# Altium schematic sheet 48V_Converter.SchDoc
size A
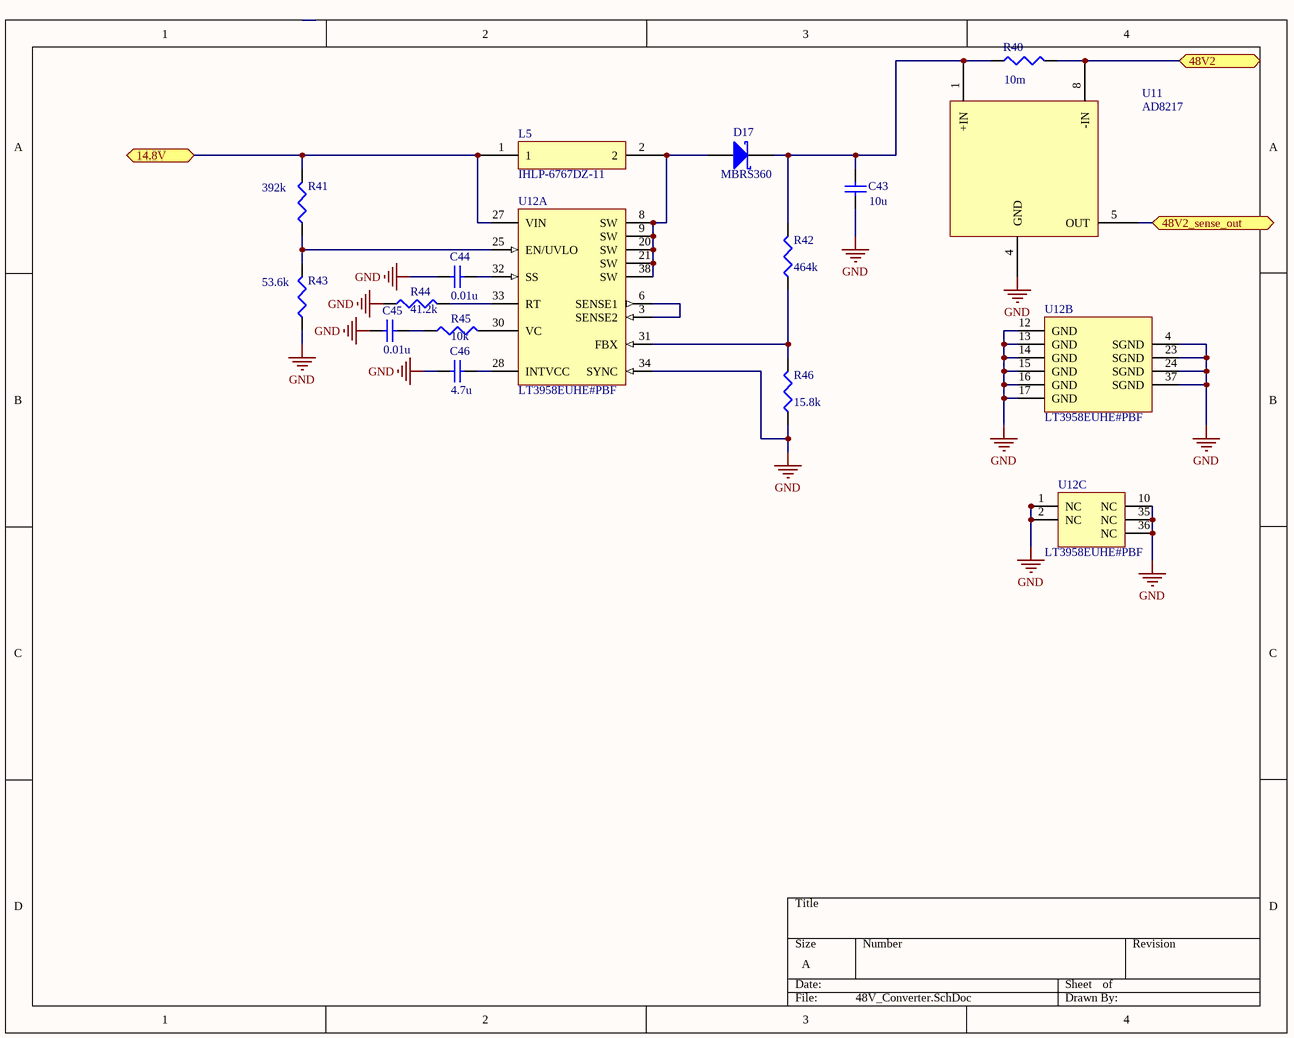
[diagram p0: 48V_Converter.SchDoc]

## Parts
C43  value 10u  [C1206]  (hidden comment: Cap Semi)
C44  value 0.01u  [C1206]  (hidden comment: Cap Semi)
C45  value 0.01u  [C1206]  (hidden comment: Cap Semi)
C46  value 4.7u  [C1206]  (hidden comment: Cap Semi)
D17  MBRS360  [SMB]
L5  IHLP-6767DZ-11  [IHLP-6767DZ-11]
R40  value 10m  [J1-0603]  (hidden comment: Res3)
R41  value 392k  [J1-0603]  (hidden comment: Res3)
R42  value 464k  [J1-0603]  (hidden comment: Res3)
R43  value 53.6k  [J1-0603]  (hidden comment: Res3)
R44  value 41.2k  [J1-0603]  (hidden comment: Res3)
R45  value 10k  [J1-0603]  (hidden comment: Res3)
R46  value 15.8k  [J1-0603]  (hidden comment: Res3)
U11  AD8217  [AD8217]
U12  LT3958EUHE#PBF  [LT3958]  (parts A,B,C of 3)

## Ports
14.8V, 48V2, 48V2_sense_out

## Nets
GND: C43.1 C44.1 C45.1 C46.1 R43.1 R44.1 R46.1 U11.4(GND) U12.1(NC) U12.2(NC) U12.4(SGND) U12.10(NC) U12.12(GND) U12.13(GND) U12.14(GND) U12.15(GND) U12.16(GND) U12.17(GND) U12.23(SGND) U12.24(SGND) U12.34(SYNC) U12.35(NC) U12.36(NC) U12.37(SGND)
14.8V: L5.1 R41.2 U12.27(VIN) ; port 14.8V
48V2: R40.2 U11.8(-IN) ; port 48V2
48V2_sense_out: U11.5(OUT) ; port 48V2_sense_out
NetC43_2: C43.2 D17.2(K) R40.1 R42.2 U11.1(+IN)
NetC44_2: C44.2 U12.32(SS)
NetC45_2: C45.2 R45.1
NetC46_2: C46.2 U12.28(INTVCC)
NetD17_1: D17.1(A) L5.2 U12.8(SW) U12.9(SW) U12.20(SW) U12.21(SW) U12.38(SW)
NetR41_1: R41.1 R43.2 U12.25(EN/UVLO)
NetR42_1: R42.1 R46.2 U12.31(FBX)
NetR44_2: R44.2 U12.33(RT)
NetR45_2: R45.2 U12.30(VC)
NetU12_3: U12.3(SENSE2) U12.6(SENSE1)

## Library data of the parts
C43-C46 = Cap Semi: Capacitor (Semiconductor SIM Model); Published: 8-Jun-2000; LatestRevisionDate: 29-May-2009; LatestRevisionNote: IPC-7351 Footprint Added.; PackageReference: C1206; Publisher: Altium Limited; PackageDescription: Chip Capacitor
D17 = D Schottky: Schottky Diode; Published: 8-Jun-2000; LatestRevisionDate: 17-Jul-2002; LatestRevisionNote: Re-released for DXP Platform.; PackageReference: SMB; Publisher: Altium Limited; PackageDescription: DO-214-AA/SMB; 2 C-Bend Leads; Body 5.3 x 3.6 mm, inc. leads (LxW); Code_JEDEC: DO-214-AA
L5 = IHLP-6767DZ-11: Inductor
R40-R46 = Res3: Resistor; Published: 8-Jun-2000; LatestRevisionDate: 29-May-2009; LatestRevisionNote: IPC-7351 Footprint Added.; PackageReference: J1-0603; Publisher: Altium Limited; PackageDescription: Chip Resistor
U11 = AD8217: Current Shunt Moniter
U12 = LT3958EUHE#PBF: LT3958; Manufacturer: Linear Technology; Frequency Adjust Range: 100kHz - 1MHz; Number of Outputs: 1; ComponentLink1Description: Manufacturer URL; ComponentLink1URL: http://www.linear.com/; ComponentLink2Description: Datasheet; ComponentLink2URL: http://cds.linear.com/docs/en/datasheet/3958f.pdf; ComponentLink3Description: Package Specification; ComponentLink3URL: http://cds.linear.com/docs/en/packaging/QFN_28_05-08-1836.pdf; Mounting Technology: Surface Mount; PackageDescription: 28-Pin Plastic QFN, Body 5 x 6 mm, Pitch 0.5 mm; PackageReference: UHE-36; PackageVersion: Rev. D, 02/2012; PartNumber: LT3958EUHE#PBF; RoHS: TRUE; Supplier 1: Digi-Key; Supplier 2: Farnell; Supplier 3: Newark; Supplier Part Number 1: LT3958EUHE#PBF-ND; Supplier Part Number 2: 2294964; Supplier Part Number 3: 78R9566